# Altium project IoT.QUAKE REV01.PrjPCB
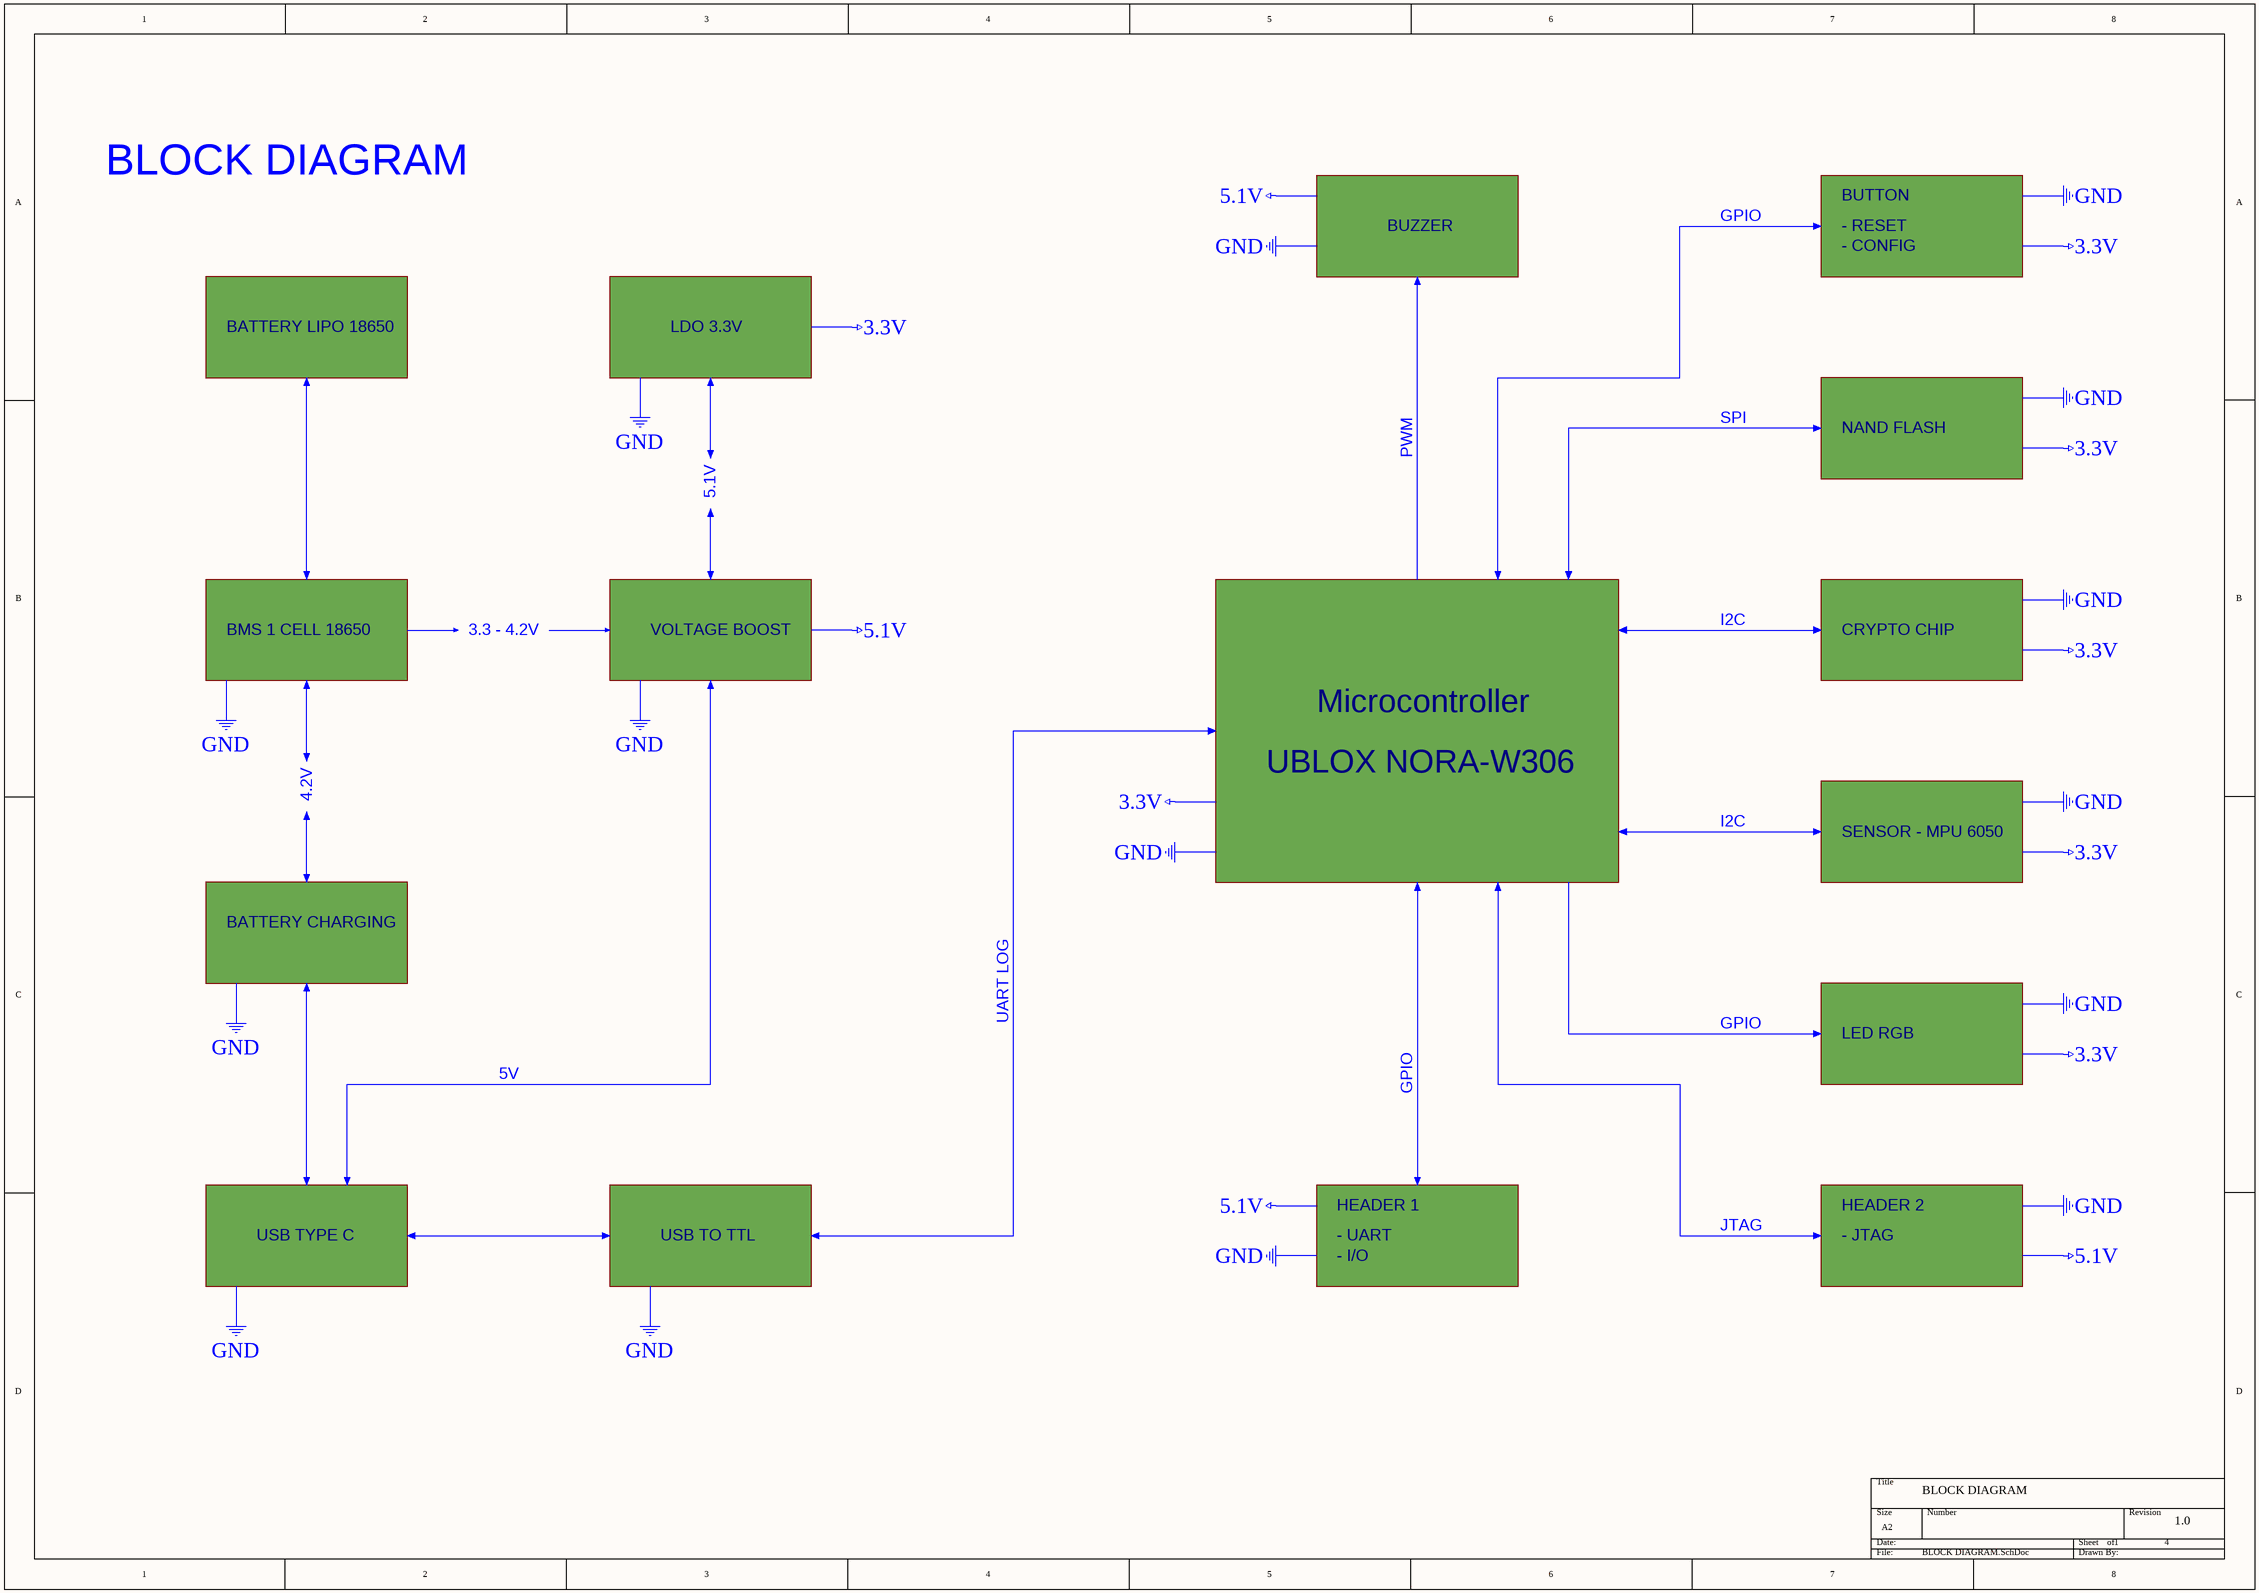
[diagram p0: BLOCK DIAGRAM.SchDoc]
4 sheets, 108 parts. Net scope: global (net labels, ports and power ports of the same name join across sheets).
Board file: IoT.QUAKE REV01.PcbDoc
Sheets:
  BLOCK DIAGRAM.SchDoc
  HISTORY TABLE.SchDoc
  GPIO TABLE.SchDoc
  IoT.QUAKE REV01.SchDoc

## Sheet BLOCK DIAGRAM.SchDoc
size A2; Organization: Altium Limited; Address1: L3, 12a Rodborough Rd; Address2: Frenchs Forest; Address3: NSW; Address4: Australia 2086

### Notes on the sheet
- BLOCK DIAGRAM
- BUZZER
- GPIO
- BUTTON
- - RESET
- - CONFIG
- BATTERY LIPO 18650
- LDO 3.3V
- SPI
- NAND FLASH
- 5.1V
- PWM
- BMS 1 CELL 18650
- 3.3 - 4.2V
- VOLTAGE BOOST
- I2C
- CRYPTO CHIP
- Microcontroller
- 4.2V
- UBLOX NORA-W306
- SENSOR - MPU 6050
- BATTERY CHARGING
- UART LOG
- LED RGB
- 5V
- USB TYPE C
- USB TO TTL
- HEADER 1
- - UART
- JTAG
- HEADER 2
- - JTAG
- - I/O
- 1
- 4
- 1.0
- Labels drawn without touching a wire or pin: 3.3V, 5.1V, GND
- Title
- Size:
- Date:
- File:
- A2
- Number:
- Time:
- Revision:
- Sheet
- of

## Sheet HISTORY TABLE.SchDoc
size A2; Organization: Altium Limited; Address1: L3, 12a Rodborough Rd; Address2: Frenchs Forest; Address3: NSW; Address4: Australia 2086
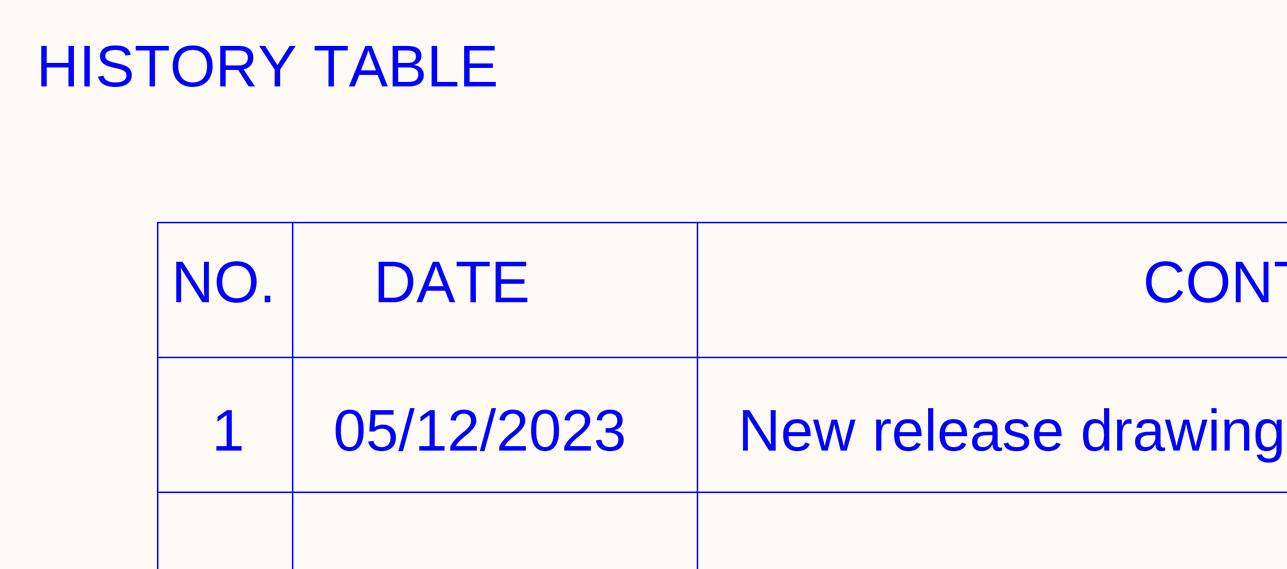
[diagram p1: HISTORY TABLE.SchDoc, left]
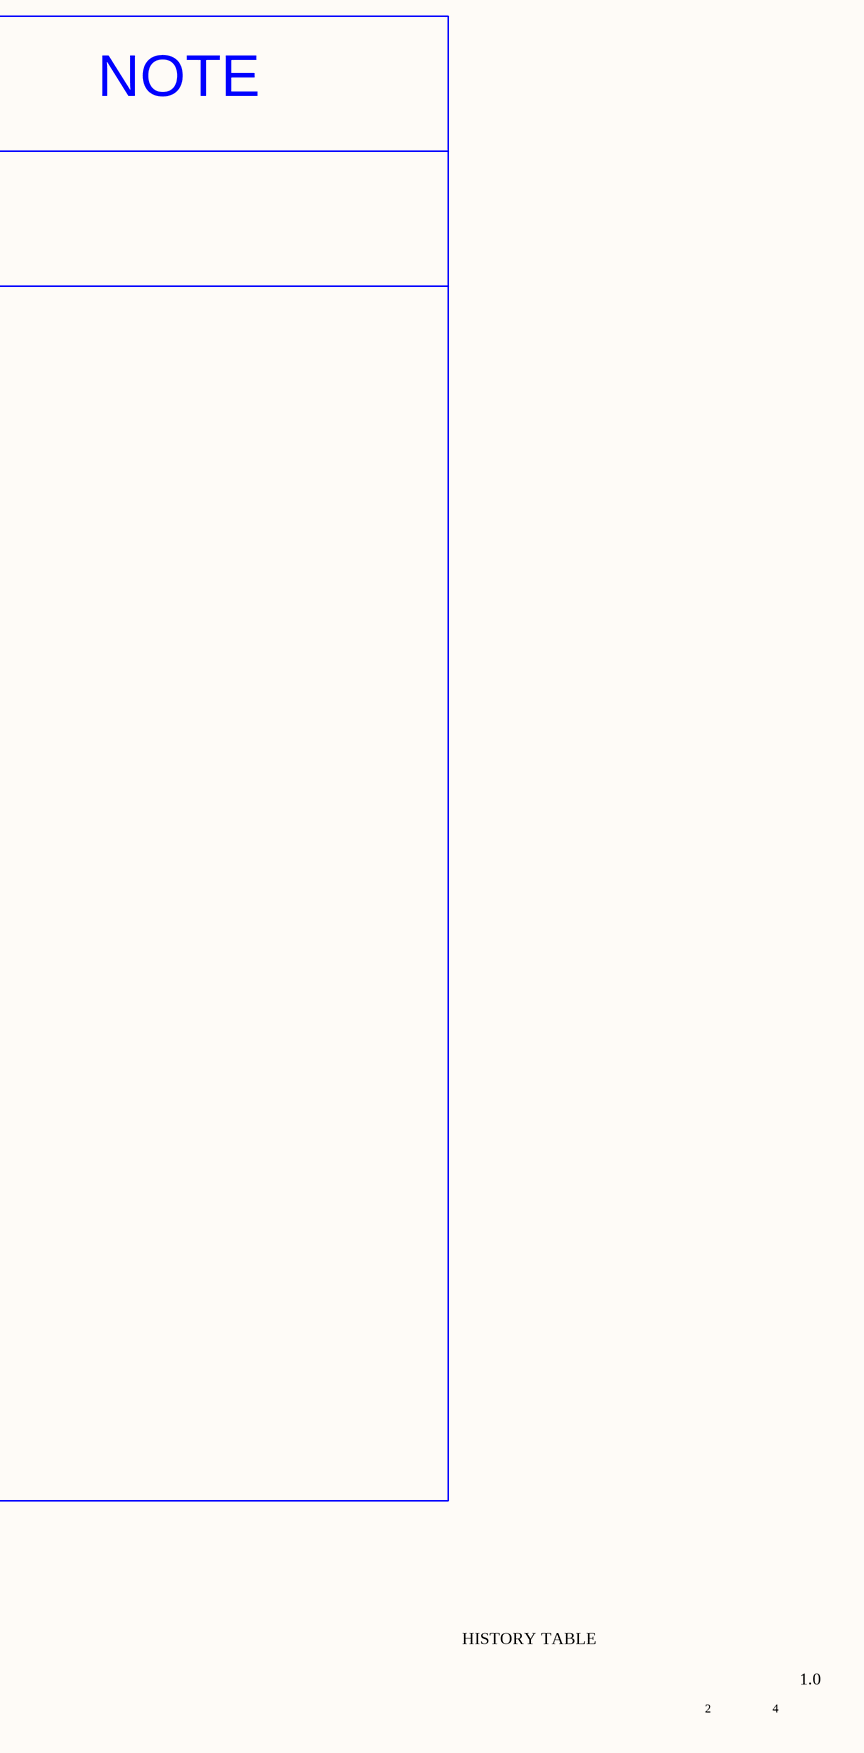
[diagram p2: HISTORY TABLE.SchDoc, right]

### Notes on the sheet
- HISTORY TABLE
- NO.
- DATE
- CONTENT
- NOTE
- 1
- 05/12/2023
- New release drawing version 1.0
- 2
- 4
- 1.0
- Title
- Size:
- Date:
- A4
- Number:
- Time:
- Revision:
- Sheet
- of
- File:

## Sheet GPIO TABLE.SchDoc
size A2; Organization: Altium Limited; Address1: L3, 12a Rodborough Rd; Address2: Frenchs Forest; Address3: NSW; Address4: Australia 2086
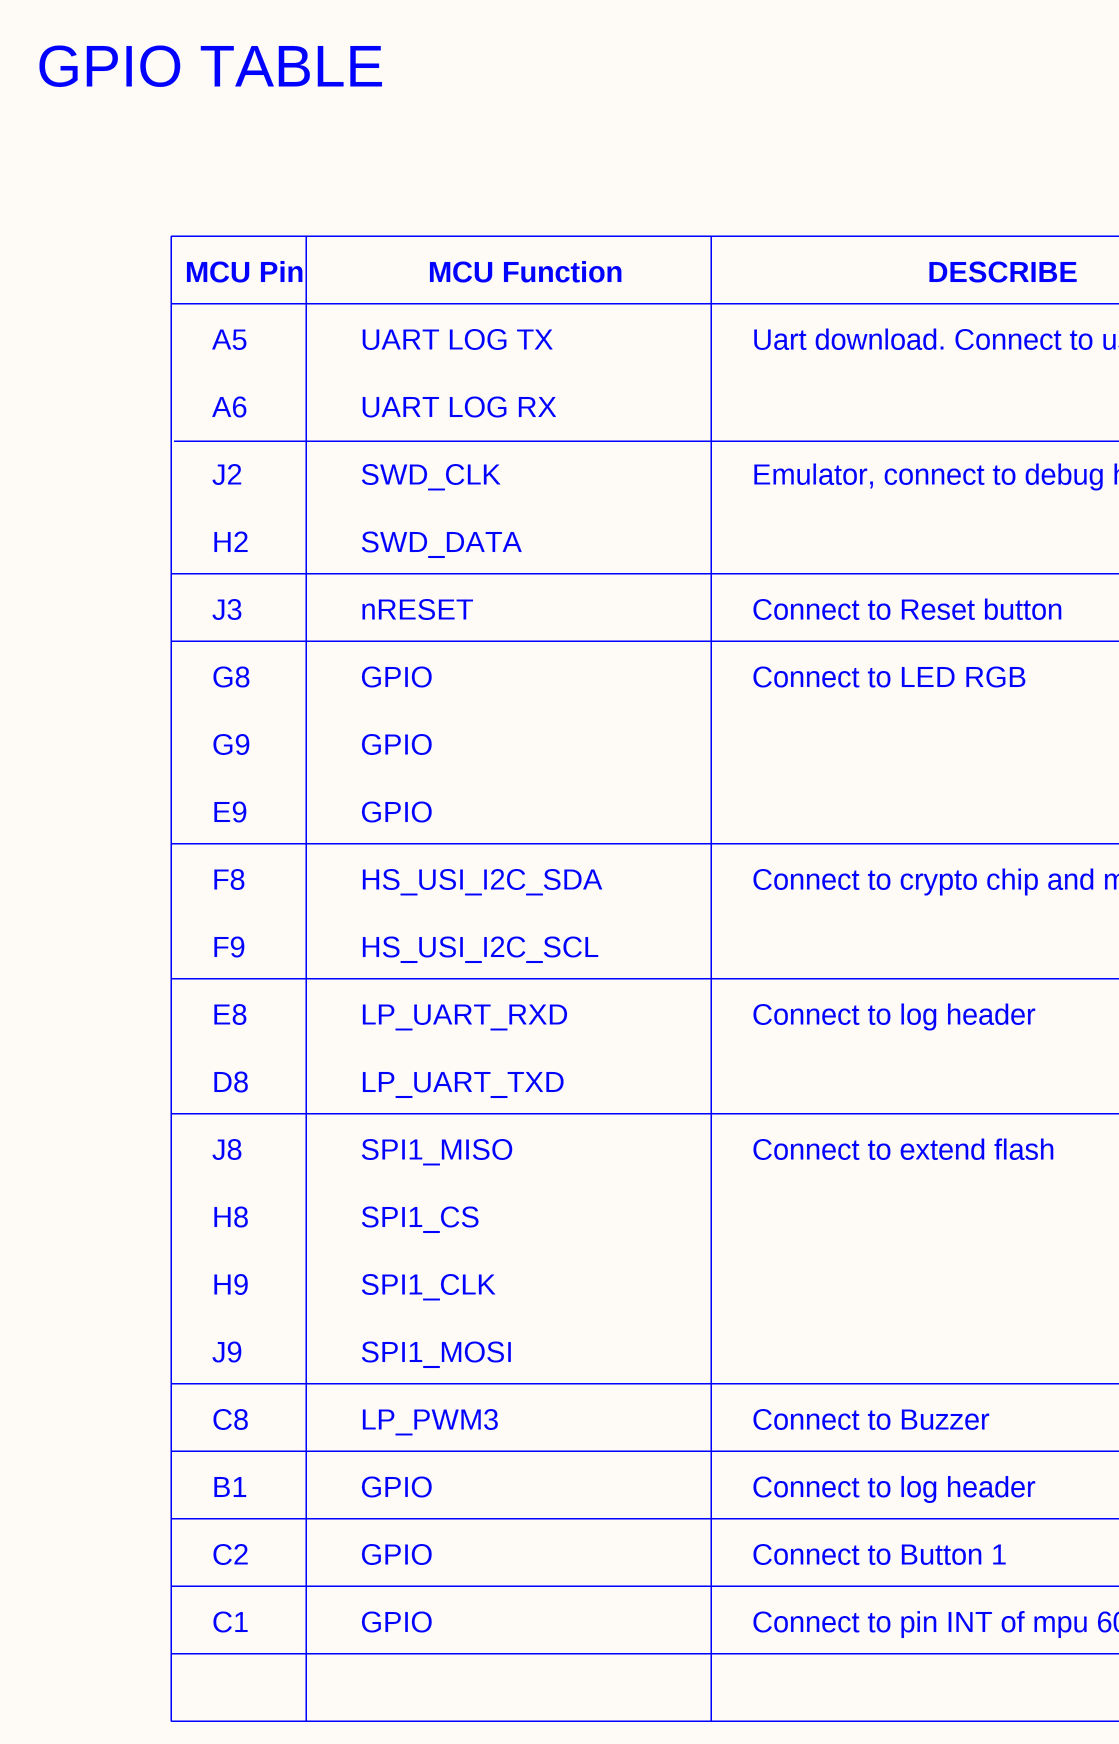
[diagram p3: GPIO TABLE.SchDoc, left]
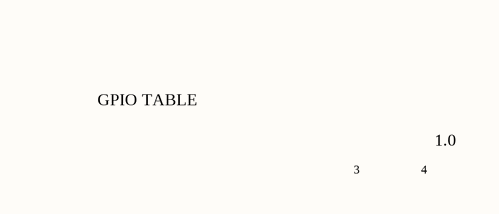
[diagram p4: GPIO TABLE.SchDoc, right]

### Notes on the sheet
- GPIO TABLE
- MCU Pin
- MCU Function
- DESCRIBE
- A5
- UART LOG TX
- Uart download. Connect to usb to ttl (cp2102)
- A6
- UART LOG RX
- J2
- SWD_CLK
- Emulator, connect to debug header
- H2
- SWD_DATA
- J3
- nRESET
- Connect to Reset button
- G8
- GPIO
- Connect to LED RGB
- G9
- E9
- F8
- HS_USI_I2C_SDA
- Connect to crypto chip and mpu 6050
- F9
- HS_USI_I2C_SCL
- E8
- LP_UART_RXD
- Connect to log header
- D8
- LP_UART_TXD
- J8
- SPI1_MISO
- Connect to extend flash
- H8
- SPI1_CS
- H9
- SPI1_CLK
- J9
- SPI1_MOSI
- C8
- LP_PWM3
- Connect to Buzzer
- B1
- C2
- Connect to Button 1
- C1
- Connect to pin INT of mpu 6050
- 3
- 4
- 1.0
- Title
- Size:
- Date:
- A4
- Number:
- Time:
- Revision:
- Sheet
- of
- File:

## Sheet IoT.QUAKE REV01.SchDoc
size A2; Organization: Altium Limited; Address1: L3, 12a Rodborough Rd; Address2: Frenchs Forest; Address3: NSW; Address4: Australia 2086
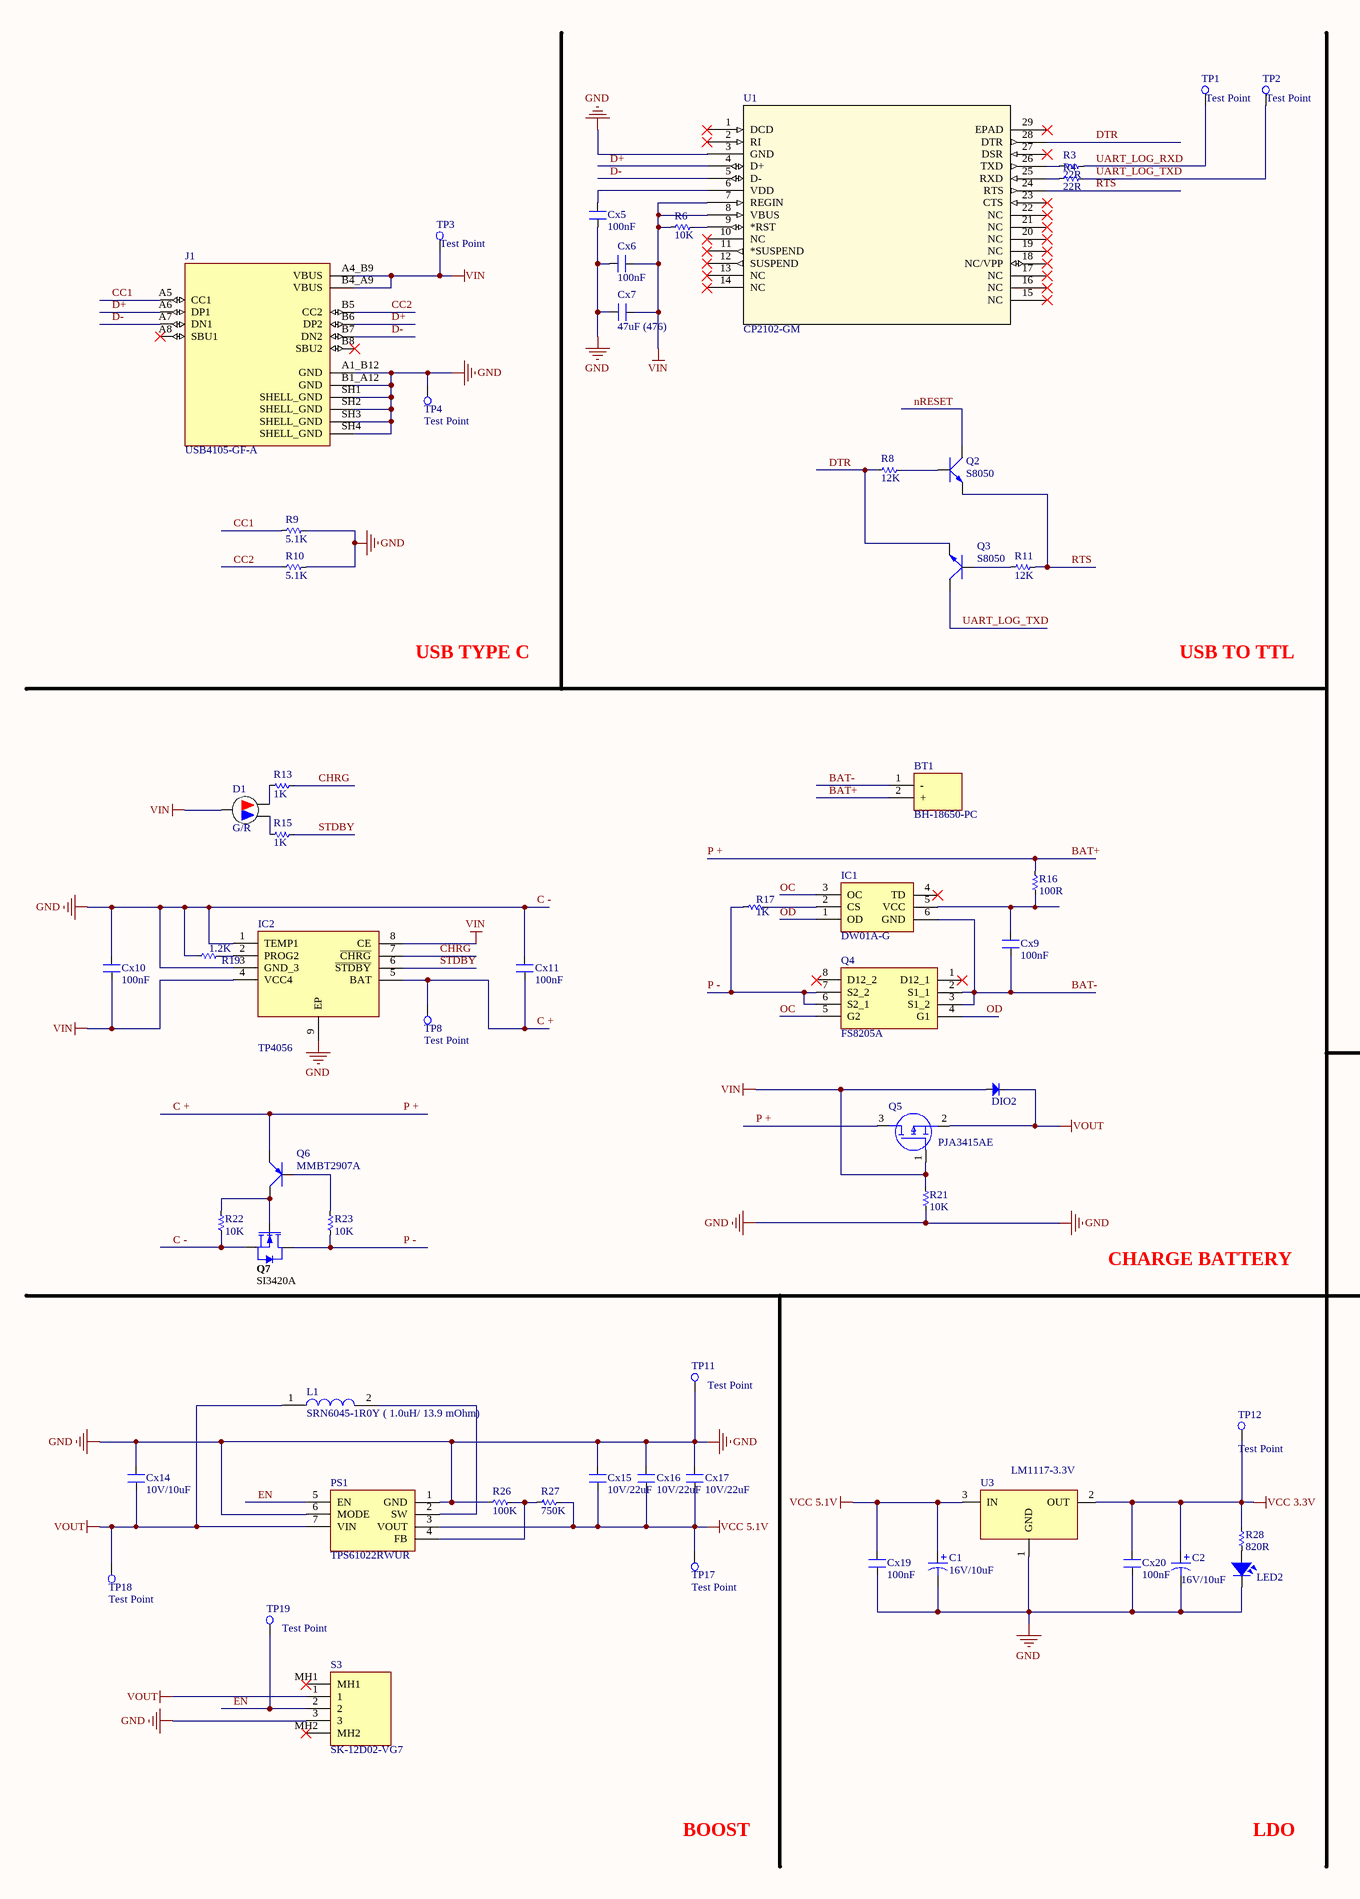
[diagram p5: IoT.QUAKE REV01.SchDoc, left]
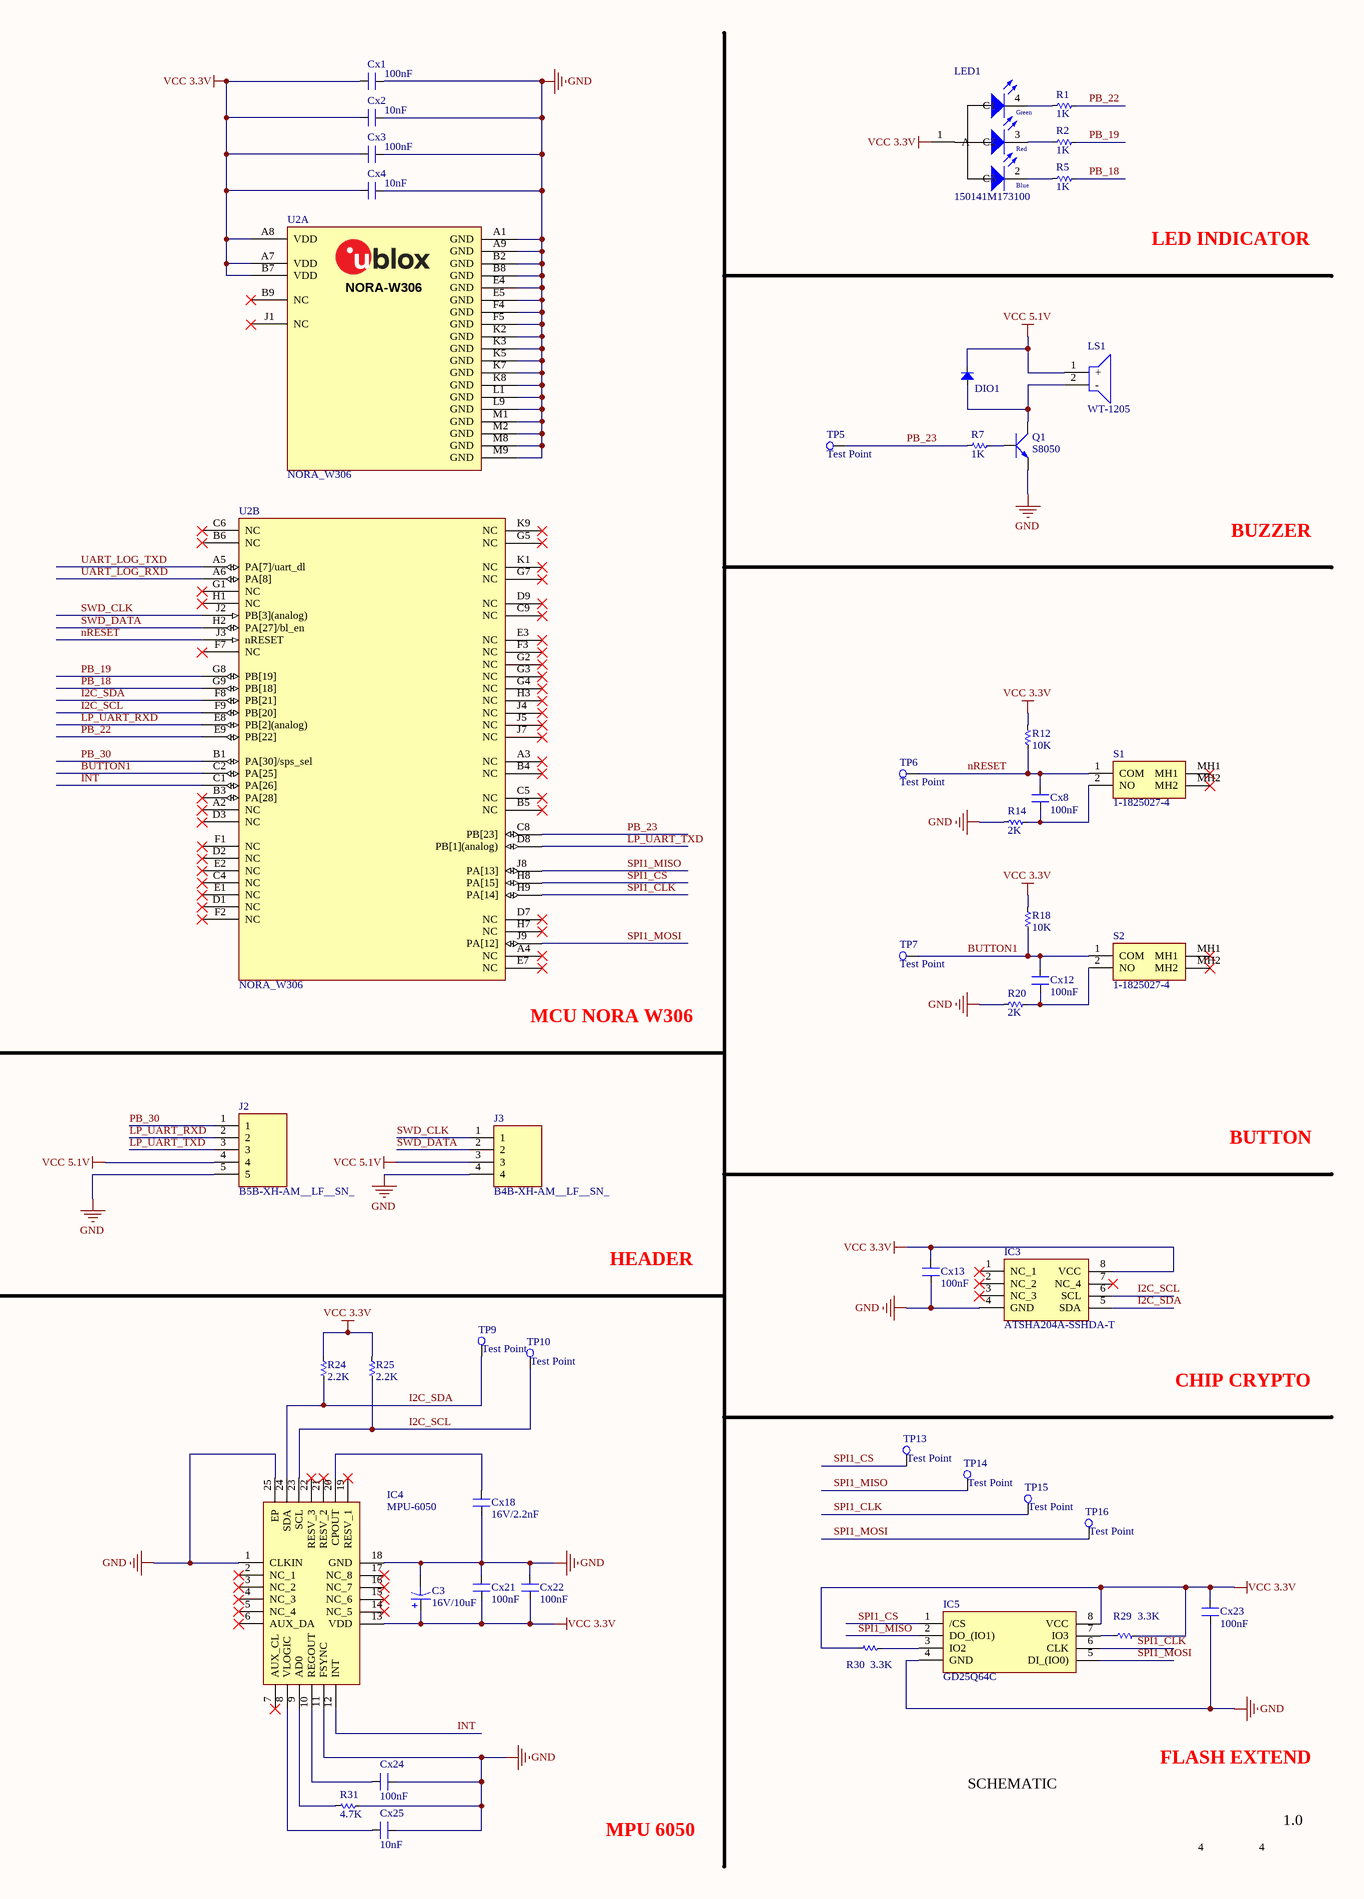
[diagram p6: IoT.QUAKE REV01.SchDoc, right]

### Parts
BT1  BH-18650-PC  [BH18650PC]
C1  16V/10uF  [CAP POL 1206_3216]
C2  16V/10uF  [CAP POL 1206_3216]
C3  16V/10uF  [CAP POL 1206_3216]
Cx1  100nF  [CN-SMD-0603]
Cx2  10nF  [CN-SMD-0603]
Cx3  100nF  [CN-SMD-0603]
Cx4  10nF  [CN-SMD-0603]
Cx5  100nF  [CN-SMD-0603]
Cx6  100nF  [CN-SMD-0603]
Cx7  47uF (476)  [CN-SMD-0805]
Cx8  100nF  [CN-SMD-0603]
Cx9  100nF  [CN-SMD-0603]
Cx10  100nF  [CN-SMD-0603]
Cx11  100nF  [CN-SMD-0603]
Cx12  100nF  [CN-SMD-0603]
Cx13  100nF  [CN-SMD-0603]
Cx14  10V/10uF  [CN-SMD-0805]
Cx15  10V/22uF  [CN-SMD-0805]
Cx16  10V/22uF  [CN-SMD-0805]
Cx17  10V/22uF  [CN-SMD-0805]
Cx18  16V/2.2nF  [CN-SMD-0603]
Cx19  100nF  [CN-SMD-0603]
Cx20  100nF  [CN-SMD-0603]
Cx21  100nF  [CN-SMD-0603]
Cx22  100nF  [CN-SMD-0603]
Cx23  100nF  [CN-SMD-0603]
Cx24  100nF  [CN-SMD-0603]
Cx25  10nF  [CN-SMD-0603]
D1  G/R  [LED_3MM_DUALCOLOR]
DIO1  Diode SMD SS34F  [DIO-SMD-123]  (value not drawn)
DIO2  Diode SMD SS34F  [DIO-SMD-123]  (value not drawn)
IC1  DW01A-G  [SOT95P280X135-6N]
IC2  TP4056  [SOIC127P600X175-9N]
IC3  ATSHA204A-SSHDA-T  [SOIC127P600X175-8N]
IC4  MPU-6050  [MPU6050]
IC5  GD25Q64C  [SOIC127P790X216-8N]
J1  USB4105-GF-A  [GCT_USB4105-GF-A]
J2  B5B-XH-AM__LF__SN_  [B5BXHAMLFSN]
J3  B4B-XH-AM__LF__SN_  [B4BXHAMLFSN]
L1  SRN6045-1R0Y ( 1.0uH/ 13.9 mOhm)  [SRN60451R0Y]
LED1  150141M173100  [LED RGB 3528]
LED2  LED  [LED-0805-Green]  (value not drawn)
LS1  WT-1205  [WT1205]
PS1  TPS61022RWUR  [TPS61022RWUR]
Q1  S8050  [SOT23-231]
Q2  S8050  [SOT23-231]
Q3  S8050  [SOT23-231]
Q4  FS8205A  [SOP65P640X120-8N]
Q5  PJA3415AE  [PJA3415AEAU_R2_000A1]
Q6  MMBT2907A  [SOT23-231]
Q7  SI3420A  [SOT23-123]
R1  1K  [RES-SMD-0603]
R2  1K  [RES-SMD-0603]
R3  22R  [RES-SMD-0603]
R4  22R  [RES-SMD-0603]
R5  1K  [RES-SMD-0603]
R6  10K  [RES-SMD-0603]
R7  1K  [RES-SMD-0603]
R8  12K  [RES-SMD-0603]
R9  5.1K  [RES-SMD-0603]
R10  5.1K  [RES-SMD-0603]
R11  12K  [RES-SMD-0603]
R12  10K  [RES-SMD-0603]
R13  1K  [RES-SMD-0603]
R14  2K  [RES-SMD-0603]
R15  1K  [RES-SMD-0603]
R16  100R  [RES-SMD-0603]
R17  1K  [RES-SMD-0603]
R18  10K  [RES-SMD-0603]
R19  1.2K  [RES-SMD-0603]
R20  2K  [RES-SMD-0603]
R21  10K  [RES-SMD-0603]
R22  10K  [RES-SMD-0603]
R23  10K  [RES-SMD-0603]
R24  2.2K  [RES-SMD-0603]
R25  2.2K  [RES-SMD-0603]
R26  100K  [RES-SMD-0603]
R27  750K  [RES-SMD-0603]
R28  820R  [RES-SMD-0603]
R29  3.3K  [RES-SMD-0603]
R30  3.3K  [RES-SMD-0603]
R31  4.7K  [RES-SMD-0603]
S1  1-1825027-4  [118250274]
S2  1-1825027-4  [118250274]
S3  SK-12D02-VG7  [SK12D02VG7]
TP1  Test Point  [Test Point SMD]
TP2  Test Point  [Test Point SMD]
TP3  Test Point  [Test Point SMD]
TP4  Test Point  [Test Point SMD]
TP5  Test Point  [Test Point SMD]
TP6  Test Point  [Test Point SMD]
TP7  Test Point  [Test Point SMD]
TP8  Test Point  [Test Point SMD]
TP9  Test Point  [Test Point SMD]
TP10  Test Point  [Test Point SMD]
TP11  Test Point  [Test Point SMD]
TP12  Test Point  [Test Point SMD]
TP13  Test Point  [Test Point SMD]
TP14  Test Point  [Test Point SMD]
TP15  Test Point  [Test Point SMD]
TP16  Test Point  [Test Point SMD]
TP17  Test Point  [Test Point SMD]
TP18  Test Point  [Test Point SMD]
TP19  Test Point  [Test Point SMD]
U1  CP2102-GM  [QFN28_5X5_SIL]
U2  NORA_W306  [NORA_LGA82R_1430X1040X190_W3_ANT]  (parts A,B of 2)
U3  LM1117-3.3V  [SOT223]

### Nets
C -: C1.2 C2.2 C3.2 Cx1.1 Cx2.1 Cx3.1 Cx4.1 Cx5.1 Cx6.2 Cx7.1 Cx10.2 Cx11.2 Cx13.1 Cx14.2 Cx15.2 Cx16.2 Cx17.2 Cx18.1 Cx19.1 Cx20.1 Cx21.2 Cx22.2 Cx23.1 Cx24.1 Cx25.1 IC2.1(TEMP1) IC2.3(GND_3) IC2.9(EP) IC3.4(GND) IC4.1(CLKIN) IC4.11(FSYNC) IC4.18(GND) IC4.25(EP) IC5.4(GND) J1.A1_B12(GND) J1.B1_A12(GND) J1.SH1(SHELL_GND) J1.SH2(SHELL_GND) J1.SH3(SHELL_GND) J1.SH4(SHELL_GND) J2.5 J3.4 LED2.2 PS1.1(GND) PS1.6(MODE) Q1.1(E) Q7.3(S) R9.1 R10.1 R14.2 R19.2 R20.2 R21.2 R22.2 R26.2 R31.2 S3.3 TP4.1 TP11.1 U1.3(GND) U2.A1(GND) U2.A9(GND) U2.B2(GND) U2.B8(GND) U2.E4(GND) U2.E5(GND) U2.F4(GND) U2.F5(GND) U2.K2(GND) U2.K3(GND) U2.K5(GND) U2.K7(GND) U2.K8(GND) U2.L1(GND) U2.L9(GND) U2.M1(GND) U2.M2(GND) U2.M8(GND) U2.M9(GND) U3.1(GND)  [also labelled GND]
VCC 3.3V: C2.1 C3.1 Cx1.2 Cx2.2 Cx3.2 Cx4.2 Cx13.2 Cx20.2 Cx21.1 Cx22.1 Cx23.2 IC3.8(VCC) IC4.13(VDD) IC5.8(VCC) LED1.1(A) R12.2 R18.2 R24.1 R25.1 R28.1 R29.1 R30.1 TP12.1 U2.A7(VDD) U2.A8(VDD) U2.B7(VDD) U3.2(OUT)
VCC 5.1V: C1.1 Cx15.1 Cx16.1 Cx17.1 Cx19.2 DIO1.2(K) J2.4 J3.3 LS1.1(+) PS1.3(VOUT) R27.2 TP17.1 U3.3(IN)
VIN: Cx6.1 Cx7.2 Cx10.1 D1.2(A) DIO2.1(A) IC2.4(VCC4) IC2.8(CE) J1.A4_B9(VBUS) J1.B4_A9(VBUS) Q5.1(G) R6.2 R21.1 TP3.1 U1.7(REGIN) U1.8(VBUS)
VOUT: Cx14.1 DIO2.2(K) L1.1 PS1.7(VIN) Q5.2(S) S3.1 TP18.1
BAT+: BT1.2(+) Cx11.1 IC2.5(BAT) Q5.3(D) Q6.1(E) R16.1 TP8.1  [also labelled C +, P +]
BAT-: BT1.1(-) Cx9.1 IC1.6(GND) Q4.2(S1_1) Q4.3(S1_2)
BUTTON1: Cx12.2 R18.1 S2.1(COM) TP7.1 U2.C2(PA[25])
CC1: J1.A5(CC1) R9.2
CC2: J1.B5(CC2) R10.2
CHRG: IC2.7(~{CHRG}) R13.2
D+: J1.A6(DP1) J1.B6(DP2) U1.4(D+)
D-: J1.A7(DN1) J1.B7(DN2) U1.5(D-)
DTR: Q3.1(E) R8.1 U1.28(DTR)
EN: PS1.5(EN) S3.2 TP19.1
I2C_SCL: IC3.6(SCL) IC4.23(SCL) R25.2 TP10.1 U2.F9(PB[20])
I2C_SDA: IC3.5(SDA) IC4.24(SDA) R24.2 TP9.1 U2.F8(PB[21])
INT: IC4.12(INT) U2.C1(PA[26])
LP_UART_RXD: J2.2 U2.E8(PB[2](analog))
LP_UART_TXD: J2.3 U2.D8(PB[1](analog))
nRESET: Cx8.2 Q2.3(C) R12.1 S1.1(COM) TP6.1 U2.J3(nRESET)
OC: IC1.3(OC) Q4.5(G2)
OD: IC1.1(OD) Q4.4(G1)
P -: Q4.6(S2_1) Q4.7(S2_2) Q7.2(D) R17.2 R23.2
PB_18: R5.1 U2.G9(PB[18])
PB_19: R2.1 U2.G8(PB[19])
PB_22: R1.1 U2.E9(PB[22])
PB_23: R7.1 TP5.1 U2.C8(PB[23])
PB_30: J2.1 U2.B1(PA[30]/sps_sel)
RTS: Q2.1(E) R11.2 U1.24(RTS)
SPI1_CLK: IC5.6(CLK) TP15.1 U2.H9(PA[14])
SPI1_CS: IC5.1(/CS) TP13.1 U2.H8(PA[15])
SPI1_MISO: IC5.2(DO_(IO1)) TP14.1 U2.J8(PA[13])
SPI1_MOSI: IC5.5(DI_(IO0)) TP16.1 U2.J9(PA[12])
STDBY: IC2.6(~{STDBY}) R15.2
SWD_CLK: J3.1 U2.J2(PB[3](analog))
SWD_DATA: J3.2 U2.H2(PA[27]/bl_en)
UART_LOG_RXD: R3.1 TP1.1 U2.A6(PA[8])
UART_LOG_TXD: Q3.3(C) R4.1 TP2.1 U2.A5(PA[7]/uart_dl)
NetCx5_2: Cx5.2 U1.6(VDD)
NetCx8_1: Cx8.1 R14.1 S1.2(NO)
NetCx9_2: Cx9.2 IC1.5(VCC) R16.2
NetCx12_1: Cx12.1 R20.1 S2.2(NO)
NetCx18_2: Cx18.2 IC4.20(CPOUT)
NetCx24_2: Cx24.2 IC4.10(REGOUT)
NetCx25_2: Cx25.2 IC4.8(VLOGIC)
NetD1_1: D1.1(KR) R15.1
NetD1_3: D1.3(KB) R13.1
NetDIO1_1: DIO1.1(A) LS1.2(-) Q1.3(C)
NetIC1_2: IC1.2(CS) R17.1
NetIC2_2: IC2.2(PROG2) R19.1
NetIC4_9: IC4.9(AD0) R31.1
NetIC5_3: IC5.3(IO2) R30.2
NetIC5_7: IC5.7(IO3) R29.2
NetL1_2: L1.2 PS1.2(SW)
NetLED1_2: LED1.2(C3) R5.2
NetLED1_3: LED1.3(C2) R2.2
NetLED1_4: LED1.4(C1) R1.2
NetLED2_1: LED2.1 R28.2
NetPS1_4: PS1.4(FB) R26.1 R27.1
NetQ1_2: Q1.2(B) R7.2
NetQ2_2: Q2.2(B) R8.2
NetQ3_2: Q3.2(B) R11.1
NetQ6_2: Q6.2(B) R23.1
NetQ6_3: Q6.3(C) Q7.1(G) R22.1
NetR3_2: R3.2 U1.26(TXD)
NetR4_2: R4.2 U1.25(RXD)
NetR6_1: R6.1 U1.9(*RST)

Not connected (* = marked no-connect by the designer): IC1 4(TD)*; IC3 1(NC_1)* 2(NC_2)* 3(NC_3)* 7(NC_4)*; IC4 2(NC_1)* 3(NC_2)* 4(NC_3)* 5(NC_4)* 6(AUX_DA)* 7(AUX_CL)* 14(NC_5)* 15(NC_6)* 16(NC_7)* 17(NC_8)* 19(RESV_1)* 21(RESV_2)* 22(RESV_3)*; J1 A8(SBU1)* B8(SBU2)*; Q4 1(D12_1)* 8(D12_2)*; S1 MH1* MH2*; S2 MH1* MH2*; S3 MH1* MH2*; U1 1(DCD)* 2(RI)* 10(NC)* 11(*SUSPEND)* 12(SUSPEND)* 13(NC)* 14(NC)* 15(NC)* 16(NC)* 17(NC)* 18(NC/VPP)* 19(NC)* 20(NC)* 21(NC)* 22(NC)* 23(CTS)* 27(DSR)* 29(EPAD)*; U2 A2(NC)* A3(NC)* A4(NC)* B3(PA[28])* B4(NC)* B5(NC)* B6(NC)* B9(NC)* C4(NC)* C5(NC)* C6(NC)* C9(NC)* D1(NC)* D2(NC)* D3(NC)* D7(NC)* D9(NC)* E1(NC)* E2(NC)* E3(NC)* E7(NC)* F1(NC)* F2(NC)* F3(NC)* F7(NC)* G1(NC)* G2(NC)* G3(NC)* G4(NC)* G5(NC)* G7(NC)* H1(NC)* H3(NC)* H7(NC)* J1(NC)* J4(NC)* J5(NC)* J7(NC)* K1(NC)* K9(NC)*

### Notes on the sheet
- LED INDICATOR
- BUZZER
- USB TYPE C
- USB TO TTL
- (near U2) MCU NORA W306
- BUTTON
- CHARGE BATTERY
- HEADER
- CHIP CRYPTO
- SCHEMATIC
- FLASH EXTEND
- BOOST
- LDO
- MPU 6050
- 4
- 1.0
- Title
- Size:
- Date:
- File:
- A2
- Number:
- Time:
- Revision:
- Sheet
- of
- (in symbol LED RGB SMD) Green; Red; Blue
- (in symbol NORA_W306, part A) NORA-W306

### Library data of the parts
BT1 = BH-18650-PC: Battery; Manufacturer_Name: Memory Protection Devices; Datasheet Link: http://www.memoryprotectiondevices.com/datasheets/BH-18650-PC-datasheet.pdf; Height: 21.31mm; Manufacturer_Part_Number: BH-18650-PC
C1-C3 = Tanta: Polarized Capacitor (Axial); Published: 8-Jun-2000; LatestRevisionDate: 17-Jul-2002; LatestRevisionNote: Re-released for DXP Platform.; PackageReference: POLAR0.8; Publisher: Altium Limited
Cx1-Cx25 = CN: Value: 33pF
D1 = LED_3MM_DUAL: LED BLUE/RED DIFFUSED T-1 T/H 3MM; MFR: SunLED; MPN: XLMDKCBD34M; Solder: WAVE; Value: B/R LED; Category: Optoelectronics; PinCount: 3
DIO1 DIO2 = Diode SMD: Default Diode; Code - JEDEC: DO-214-AB; Value: 1N5007; Published: 8-Jun-2000; Revision: July-2002: Re-released for DXP Platform.; Publisher: Altium Limited
IC1 = DW01A-G: Integrated Circuit; Manufacturer_Name: Fortune Semiconductor Corporation; Datasheet Link: http://acoptex.com/uploads/DW01A.pdf; Height: 1.35mm; Manufacturer_Part_Number: DW01A-G
IC2 = TP4056: Connector; Manufacturer_Name: NanJing Top Power; Datasheet Link: https://dlnmh9ip6v2uc.cloudfront.net/datasheets/Prototyping/TP4056.pdf; Height: 1.75mm; Manufacturer_Part_Number: TP4056
IC3 = ATSHA204A-SSHDA-T: Integrated Circuit; Manufacturer_Name: Microchip; Datasheet Link: http://ww1.microchip.com/downloads/en/DeviceDoc/ATSHA204A-Data-Sheet-40002025A.pdf; Height: 1.75mm; Manufacturer_Part_Number: ATSHA204A-SSHDA-T; Mouser Part Number: 556-ATSHA204A-SSHDAT; Mouser Price/Stock: https://www.mouser.co.uk/ProductDetail/Microchip-Technology/ATSHA204A-SSHDA-T?qs=sFmtmVcT%2FfvbSwXRgmd2Jw%3D%3D; Arrow Part Number: ATSHA204A-SSHDA-T; Arrow Price/Stock: https://www.arrow.com/en/products/atsha204a-sshda-t/microchip-technology?region=nac
IC4 = MPU-6050: Integrated Circuit; Manufacturer_Name: TDK; Datasheet Link: https://product.tdk.com/system/files/dam/doc/product/sensor/mortion-inertial/imu/data_sheet/mpu-6000-datasheet1.pdf; Height: 0.95mm; Manufacturer_Part_Number: MPU-6050; Mouser Part Number: 410-MPU-6050; Mouser Price/Stock: https://www.mouser.co.uk/ProductDetail/TDK-InvenSense/MPU-6050?qs=u4fy%2FsgLU9O14B5JgyQFvg%3D%3D; Arrow Part Number: MPU-6050; Arrow Price/Stock: https://www.arrow.com/en/products/mpu-6050/invensense?region=nac
IC5 = W25Q32JVSSIQ: Integrated Circuit; Manufacturer_Name: Winbond; Datasheet Link: https://www.winbond.com/hq/search-resource-file.jsp?partNo=W25Q32JVSSIQ&type=datasheet; Height: 2.16mm; Manufacturer_Part_Number: W25Q32JVSSIQ; Mouser Part Number: 454-W25Q32JVSSIQ; Mouser Price/Stock: https://www.mouser.co.uk/ProductDetail/Winbond/W25Q32JVSSIQ?qs=qSfuJ%252Bfl%2Fd4PGZSN0WxfCA%3D%3D; Arrow Part Number: W25Q32JVSSIQ; Arrow Price/Stock: https://www.arrow.com/en/products/w25q32jvssiq/winbond-electronics?region=nac
J1 = USB4105-GF-A: USB-C (USB TYPE-C) USB 2.0 Receptacle Connector 24 (16+8 Dummy) Position Surface Mount, Right Angle; Through Hole; MF: GCT; SnapEDA_Link: https://www.snapeda.com/parts/USB4105-GF-A/Global+Connector+Technology/view-part/?ref=snap; Package: None; Value: *; MP: USB4105-GF-A; Check_prices: https://www.snapeda.com/parts/USB4105-GF-A/Global+Connector+Technology/view-part/?ref=eda
J2 = B5B-XH-AM__LF__SN_: Connector; Manufacturer_Name: JST (JAPAN SOLDERLESS TERMINALS); Manufacturer_Part_Number: B5B-XH-AM (LF)(SN); Datasheet Link: http://uk.rs-online.com/web/p/products/1755317; Height: 7mm; Arrow Part Number: B5B-XH-AM (LF)(SN); Arrow Price/Stock: https://www.arrow.com/en/products/b5b-xh-am-lf-sn/jst-manufacturing
J3 = B4B-XH-AM__LF__SN_: Connector; Manufacturer_Name: JST (JAPAN SOLDERLESS TERMINALS); Manufacturer_Part_Number: B4B-XH-AM (LF)(SN); Datasheet Link: http://www.jst-mfg.com/product/pdf/eng/eXH.pdf; Height: 7mm; Arrow Part Number: B4B-XH-AM (LF)(SN); Arrow Price/Stock: https://www.arrow.com/en/products/b4b-xh-am-lf-sn/jst-manufacturing?region=europe
L1 = SRN6045-1R0Y: Inductor; Manufacturer_Name: Bourns; Datasheet Link: https://www.mouser.com/datasheet/2/54/srn6045-1391386.pdf; Height: 4.5mm; Manufacturer_Part_Number: SRN6045-1R0Y; Mouser Part Number: 652-SRN6045-1R0Y; Mouser Price/Stock: https://www.mouser.co.uk/ProductDetail/Bourns/SRN6045-1R0Y?qs=opBjA1TV902RZfzjK85pyQ%3D%3D; Arrow Part Number: SRN6045-1R0Y; Arrow Price/Stock: https://www.arrow.com/en/products/srn6045-1r0y/bourns?region=nac
LED1 = LED RGB SMD: SMD Full-Color Top LED, WL-SFTW, Red & Green & Blue; Manufacturer: Würth Elektronik eiSos GmbH; PartNo: 150141M173100; ComponentLink1Description: Manufacturer; ComponentLink1URL: http://www.we-online.de; Created by: Christin Otto; Created Date: June 2013; ComponentLink2Description: Datasheet; ComponentLink2URL: http://katalog.we-online.com/led/datasheet/150141M173100.pdf; Color: Red & Green & Blue
LED2 = LED SMD: Value: LED 3 - 5 ly 2 Colour
LS1 = WT-1205: Loudspeaker or Buzzer; Manufacturer_Name: Soberton Inc.; Datasheet Link: https://www.soberton.com/wp-content/uploads/2019/02/WT-1205-16-Feb-2019.pdf; Height: 10mm; Manufacturer_Part_Number: WT-1205
PS1 = TPS61022RWUR: Power Supply; Manufacturer_Name: Texas Instruments; Datasheet Link: http://www.ti.com/lit/gpn/TPS61022; Height: 1mm; Manufacturer_Part_Number: TPS61022RWUR; Mouser Part Number: 595-TPS61022RWUR; Mouser Price/Stock: https://www.mouser.co.uk/ProductDetail/Texas-Instruments/TPS61022RWUR?qs=vLWxofP3U2zlxrk4cD0iFA%3D%3D; Arrow Part Number: TPS61022RWUR; Arrow Price/Stock: https://www.arrow.com/en/products/tps61022rwur/texas-instruments?region=nac
Q1-Q3 = 2N222: NPN 600mW, ECB; Value: C1815
Q4 = FS8205A: MOSFET (N-Channel); Manufacturer_Name: Fortune Semiconductor Corporation; Datasheet Link: http://www.ic-fortune.com/upload/Download/FS8205A-DS-12_EN.pdf; Height: 1.2mm; Manufacturer_Part_Number: FS8205A
Q5 = PJA3415AE-AU_R2_000A1: MOSFET (P-Channel); Manufacturer_Name: PANJIT; Datasheet Link: https://www.panjit.com.tw/upload/datasheet/PJA3415AE-AU.pdf; Height: 1.1mm; Manufacturer_Part_Number: PJA3415AE-AU_R2_000A1; Mouser Part Number: 241-PJA3415AEAUR2000; Mouser Price/Stock: https://www.mouser.co.uk/ProductDetail/Panjit/PJA3415AE-AU_R2_000A1?qs=sPbYRqrBIVmbIZu01oGFXQ%3D%3D
Q6 = 2N3906: PNP 600mW, ECB; Value: A1015
Q7 = 2N7002: N-channel Enhancement Mode Field-effect Transistor; Transistor Type: NPN; Mounting Technology: Surface Mount; Status: Unreleased; Category: Transistor-FET
R1-R31 = Res-SMD: Resistor; Manufacturer: Generic Components; Class: Passive; Published: 08/06/2000; Publisher: Altium Hobart Technology Centre
S1 S2 = 1-1825027-4: Switch; Manufacturer_Name: TE Connectivity; Datasheet Link: https://componentsearchengine.com/Datasheets/1/1-1825027-4.pdf; Height: 7.01mm; Manufacturer_Part_Number: 1-1825027-4; Mouser Part Number: N/A; Mouser Price/Stock: https://www.mouser.co.uk/ProductDetail/TE-Connectivity/1-1825027-4?qs=6Z%252BHCgJKjncD9UhqgXDXww%3D%3D; Arrow Part Number: 1-1825027-4; Arrow Price/Stock: https://www.arrow.com/en/products/1-1825027-4/te-connectivity?region=europe
S3 = SK-12D02-VG7: Switch; Manufacturer_Name: Korean Hroparts Elec; Datasheet Link: https://datasheet.lcsc.com/szlcsc/Korean-Hroparts-Elec-SK-12D02-VG7_C136721.pdf; Height: 4.7mm; Manufacturer_Part_Number: SK-12D02-VG7
U1 = CP2102-GM: No Description Available; Mfr_Name: Silicon Labs; Copyright: Copyright (C) 2022 Ultra Librarian. All rights reserved.; Manufacturer_Part_Number: CP2102-GM; RefDes: RefDes; Type: DEV
U2 = NORA_W306: u-blox NORA-W306 Bluetooth LE and Wi-Fi module - antenna pin; Manufacturer P/N: NORA-B101-00B; Part Number: NORA-B101; Part Description: Stand-alone Bluetooth low energy module - dual-core; Body Size: 14.3 mm x 10.4 mm; Value: NORA-W101; Part Name: NORA-B101; Part_Type: Module; Manufacturer: u-blox; Height: 1.8 mm
U3 = LM1117: 800mA Low-Dropout Linear Regulator; Creator: Nguyen Ba Bien; Website: http://group3i.net